# EAGLE design dht22ow3 (EAGLE 6.5.0)
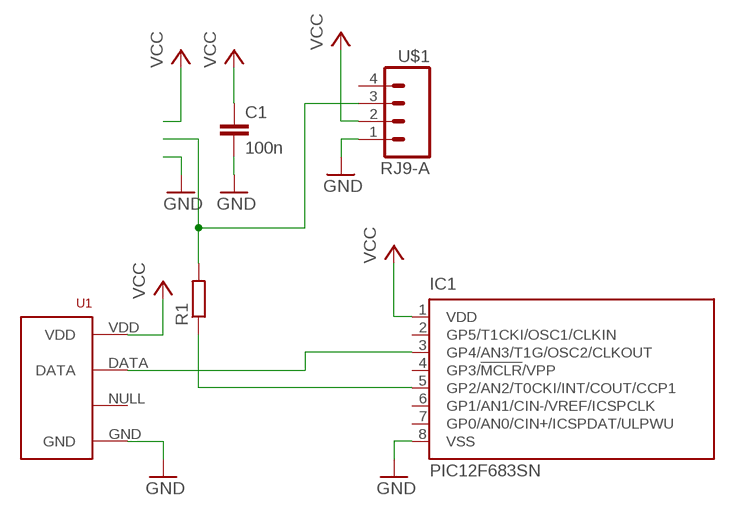
[diagram p0: schematic, sheet 1]

## Parts
C1  100n  C-EUC1206  [C1206]
IC1  PIC12F683SN  [SO-08]
R1  R-EU_R1206  [R1206]
U1  RHT03_DHT-22_AM2302RA  [RHT03_DHT-22/RA]
U$1  RJ9-A  [RJ9-A]

## Nets
GND: C1.2 IC1.8(VSS) U1.GND U$1.1
N$1: IC1.3(GP4/AN3/T1G/OSC2/CLKOUT) U1.DATA
N$2: IC1.5(GP2/AN2/T0CKI/INT/COUT/CCP1) R1.1
N$3: R1.2 U$1.3
VCC: C1.1 IC1.1(VDD) U1.VDD U$1.2
Unconnected: IC1.2(GP5/T1CKI/OSC1/CLKIN) IC1.4(GP3/!MCLR!/VPP) IC1.6(GP1/AN1/CIN-/VREF/ICSPCLK) IC1.7(GP0/AN0/CIN+/ICSPDAT/ULPWU) U1.NULL U$1.4

## Library data of the parts
C1 = rcl:C-EU: CAPACITOR, European symbol
IC1 = microchip:PIC12F683: 8-Pin Flash-Based, 8-Bit CMOS Microcontrollers with nanoWatt Technology Source: http://ww1.microchip.com/downloads/en/DeviceDoc/41211D_.pdf; MF: MICROCHIP; MPN: PIC12F683-I/SN; OC_FARNELL: 9759042; OC_NEWARK: 61K3434
R1 = rcl:R-EU_: RESISTOR, European symbol
U1 = dht22:RHT03_DHT-22_AM2302: RHT03 / DHT-22 / AM2302 Packages and symbol for the RHT03 / DHT-22 relative humidity and temperature sensor. Note: The AM2302 is a wired version of the DHT-22 which typically requires less clearance and is thus provided as a separate package.; PROD_ID: SEN-10167
U$1 = SparkFun-Connectors:RJ9-A

## Board
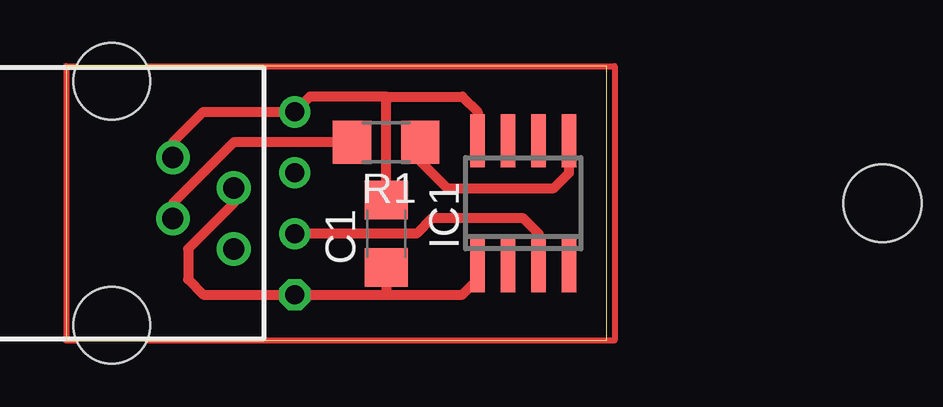
[diagram p1: board, top side]
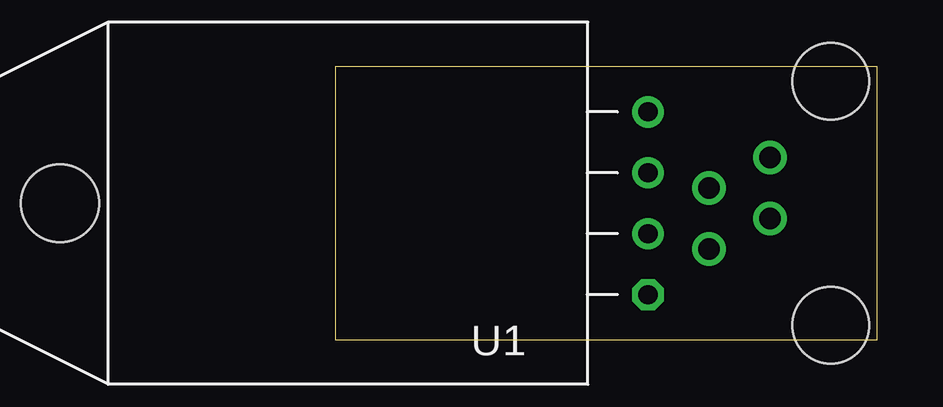
[diagram p2: board, bottom side, seen from below]

Size 22.53 x 11.42 mm. Coordinates in mm from the lower left corner, seen from the top.
Outline: 0,0 22.53,0 22.53,11.42 0,11.42 0,0
Copper layers (1*16): Top 0.035mm / dielectric 1.5mm / Bottom 0.035mm
Design rules "default": minimum track width 10mil, minimum drill 24mil, track to track 8mil, track to pad 8mil, pad to pad 8mil, via to via 8mil, smd to smd 8mil, copper to edge 40mil, drill to drill 8mil, minimum pad ring 10mil, minimum via ring 8mil, stop-mask expansion 4mil, vias tented up to drill 0mil, thermal gap 10mil

### Footprints (pad centres in the part's own frame; a part is rotated, then mirrored left to right if it is on the bottom)
C1206 = smd 1.6 x 1.8: 1 -1.4,0; 2 1.4,0
SO-08 = smd 0.6 x 2.2: 1 -1.905,-2.6; 2 -0.635,-2.6; 3 0.635,-2.6; 4 1.905,-2.6; 5 1.905,2.6; 6 0.635,2.6; 7 -0.635,2.6; 8 -1.905,2.6
R1206 = smd 1.6 x 1.803: 1 -1.422,0; 2 1.422,0
RHT03_DHT-22/RA = drill 0.8: DATA -1.27,0; GND 3.81,0; NULL 1.27,0 | drill 0.8 octagon: VDD -3.81,0 | hole 3.25: 0,24.5
RJ9-A = drill 0.889: 1 -1.905,6.35; 2 -0.635,8.89; 3 0.635,6.35; 4 1.905,8.89 | hole 3.2: -5.08,3.81; 5.08,3.81

### Placement (x,y rotation side)
C1  13.34,4.45 90 top
IC1  19.05,5.71 0 top
R1  13.34,8.26 180 top
U1  9.53,5.71 90 bottom
U$1  -1.91,5.71 270 top

### Tracks (layer width: path | path; a pad name or v marks a point on that pad's centre or on a via)
GND
  Top 0.406: 13.34,10.16 10.16,10.16 U1.GND 5.71,9.53 4.45,8.26 U$1.1 | 13.34,10.16 16.51,10.16 17.14,9.53 IC1.8 | C1.2 13.34,10.16
N$1
  Top 0.406: IC1.3 19.68,4.45 19.05,5.08 15.24,5.08 14.61,4.45 U1.DATA
N$2
  Top 0.406: R1.1 14.76,7.47 15.88,6.35 20.32,6.35 20.95,6.99 IC1.5
N$3
  Top 0.406: U$1.3 4.45,5.71 6.99,8.26 R1.2
N$10
  Top 0.254: 22.86,11.43 22.86,0 0,0 0,11.43 22.86,11.43
VCC
  Top 0.406: U$1.2 6.99,5.71 5.08,3.81 5.08,2.54 5.71,1.91 U1.VDD 13.34,1.91 | 13.34,1.91 16.51,1.91 17.14,2.54 IC1.1 | 13.34,1.91 13.34,3.17 12.7,2.54 C1.1